# Altium project Teststand.PrjPcb
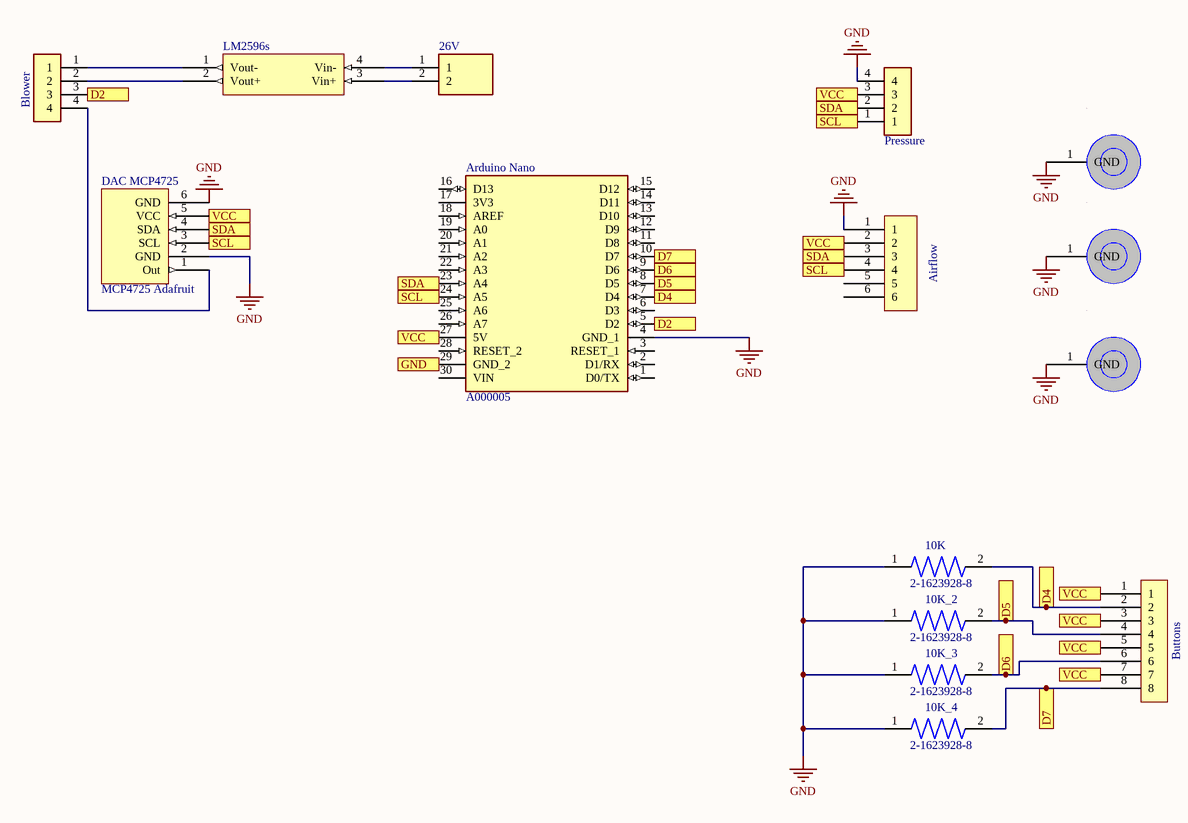
[diagram p0: Teststand.SchDoc]
1 sheet, 15 parts. Net scope: flat (ports and power ports of the same name join across sheets).
Board file: Teststand.PcbDoc

## Sheet Teststand.SchDoc
size A4; SheetNumber: 1; SheetTotal: 1

### Parts
(Parts that share a designator on the sheet are numbered #1, #2 ... from top to bottom, then left to right.)
10K  2-1623928-8  [RESAD700W45L350D185]
10K_2  2-1623928-8  [RESAD700W45L350D185]
10K_3  2-1623928-8  [RESAD700W45L350D185]
10K_4  2-1623928-8  [RESAD700W45L350D185]
26V  B2B-XH-A(LF)(SN)  [JST_B2B-XH-A(LF)(SN)]  (value not drawn)
Airflow  B6B-XH-A -LF-SN  [B6B-XH-A -LF-SN-Footprint-1]  (value not drawn)
Arduino_Nano  A000005  [MODULE_A000005]
Blower  B4B-XH-A(LF)(SN)  [JST_B4B-XH-A(LF)(SN)]  (value not drawn)
Buttons  B8B-XH-A(LF)(SN)  [B8B-XH-A(LF)(SN)-Footprint-1]  (value not drawn)
DAC_MCP4725  MCP4725 Adafruit  [New footprint 1]
LM2596s  LM2596s AZDelivery  [LM2596s AZDelivery-Footprint-1]  (value not drawn)
M3#1  3mm Mounting HOle  [3mm Mounting HOle-Footprint-1]  (value not drawn)
M3#2  3mm Mounting HOle  [3mm Mounting HOle-Footprint-1]  (value not drawn)
M3#3  3mm Mounting HOle  [3mm Mounting HOle-Footprint-1]  (value not drawn)
Pressure  B4B-XH-A(LF)(SN)  [JST_B4B-XH-A(LF)(SN)]  (value not drawn)

### Ports
D2, D4, D5, D6, D7, GND, SCL, SDA, VCC

### Nets
GND: 10K.1 10K_2.1 10K_3.1 10K_4.1 Airflow.1 Arduino_Nano.4(GND_1) DAC_MCP4725.2(GND) DAC_MCP4725.6(GND) M3#1.1(GND) M3#2.1(GND) M3#3.1(GND) Pressure.4
Net10K_2: 10K.2 Arduino_Nano.7(D4) Buttons.2 ; port D4
Net10K_2_2: 10K_2.2 Arduino_Nano.8(D5) Buttons.4 ; port D5
Net10K_3_2: 10K_3.2 Arduino_Nano.9(D6) Buttons.6 ; port D6
Net10K_4_2: 10K_4.2 Arduino_Nano.10(D7) Buttons.8 ; port D7
Net26V_1: 26V.1 LM2596s.4(Vin-)
Net26V_2: 26V.2 LM2596s.3(Vin+)
NetAirflow_2: Airflow.2 Arduino_Nano.27(5V) Buttons.1 Buttons.3 Buttons.5 Buttons.7 DAC_MCP4725.5(VCC) Pressure.3 ; port VCC
NetAirflow_3: Airflow.3 Arduino_Nano.23(A4) DAC_MCP4725.4(SDA) Pressure.2 ; port SDA
NetAirflow_4: Airflow.4 Arduino_Nano.24(A5) DAC_MCP4725.3(SCL) Pressure.1 ; port SCL
NetArduino_Nano_5: Arduino_Nano.5(D2) Blower.3 ; port D2
NetArduino_Nano_29: Arduino_Nano.29(GND_2) ; port GND
NetBlower_1: Blower.1 LM2596s.1(Vout-)
NetBlower_2: Blower.2 LM2596s.2(Vout+)
NetBlower_4: Blower.4 DAC_MCP4725.1(Out)

Not connected (* = marked no-connect by the designer): Airflow 5 6; Arduino_Nano 1(D0/TX) 2(D1/RX) 3(RESET_1) 6(D3) 11(D8) 12(D9) 13(D10) 14(D11) 15(D12) 16(D13) 17(3V3) 18(AREF) 19(A0) 20(A1) 21(A2) 22(A3) 25(A6) 26(A7) 28(RESET_2) 30(VIN)

### Library data of the parts
10K 10K_2-10K_4 = 2-1623928-8: CFR16 5% 10K; MF: {'manufacturer': u'TE Connectivity'}; MP: 2-1623928-8; Package: None; Availability: Unavailable; Price: None; Value: *
26V = B2B-XH-A(LF)(SN): XH Series 2 Position 2.5 mm Pitch Through Hole Top Entry Shrouded Header; MF: {'manufacturer': u'JST Sales America Inc.'}; Value: *; MP: B2B-XH-A(LF)(SN); Package: None; Price: None; Availability: Unavailable
Airflow = CMP-002-00073-1: Connector Header, XH Series, 6 Position, 2.50mm, Through Hole, Press-Fit, Solder, Natural
Arduino_Nano = A000005: CLOCK SAW OSCILLATOR SEAM7050 T&; MF: {'manufacturer': u'Arduino'}; Price: None; Package: None; Availability: Unavailable; Value: *; MP: A000005
Blower Pressure = CMP-003-000000-3: XH Series 4 Position 2.5 mm Pitch Through Hole Crimp Top Entry Shrouded Header; MF: {'manufacturer': u'JST Sales America Inc.'}; MP: B4B-XH-A(LF)(SN); Design Item ID: B4B-XH-A(LF)(SN); Package: None; Value: *; Availability: Unavailable; Price: None; Source: B4B-XH-A(LF)(SN).SchLib
Buttons = CMP-002-00072-2: Conn Shrouded Header HDR 8 POS 2.5mm Solder ST Thru-Hole Box
DAC_MCP4725 = CMP-001-0000-2: IC for MCP4725
LM2596s = CMP-019-00049-2: IC LM2596s
M3#1-M3#3 = CMP-001-0002-1: 2mm Mounting HOle